# Altium schematic sheet medusa-AI-sensors.SchDoc
size A
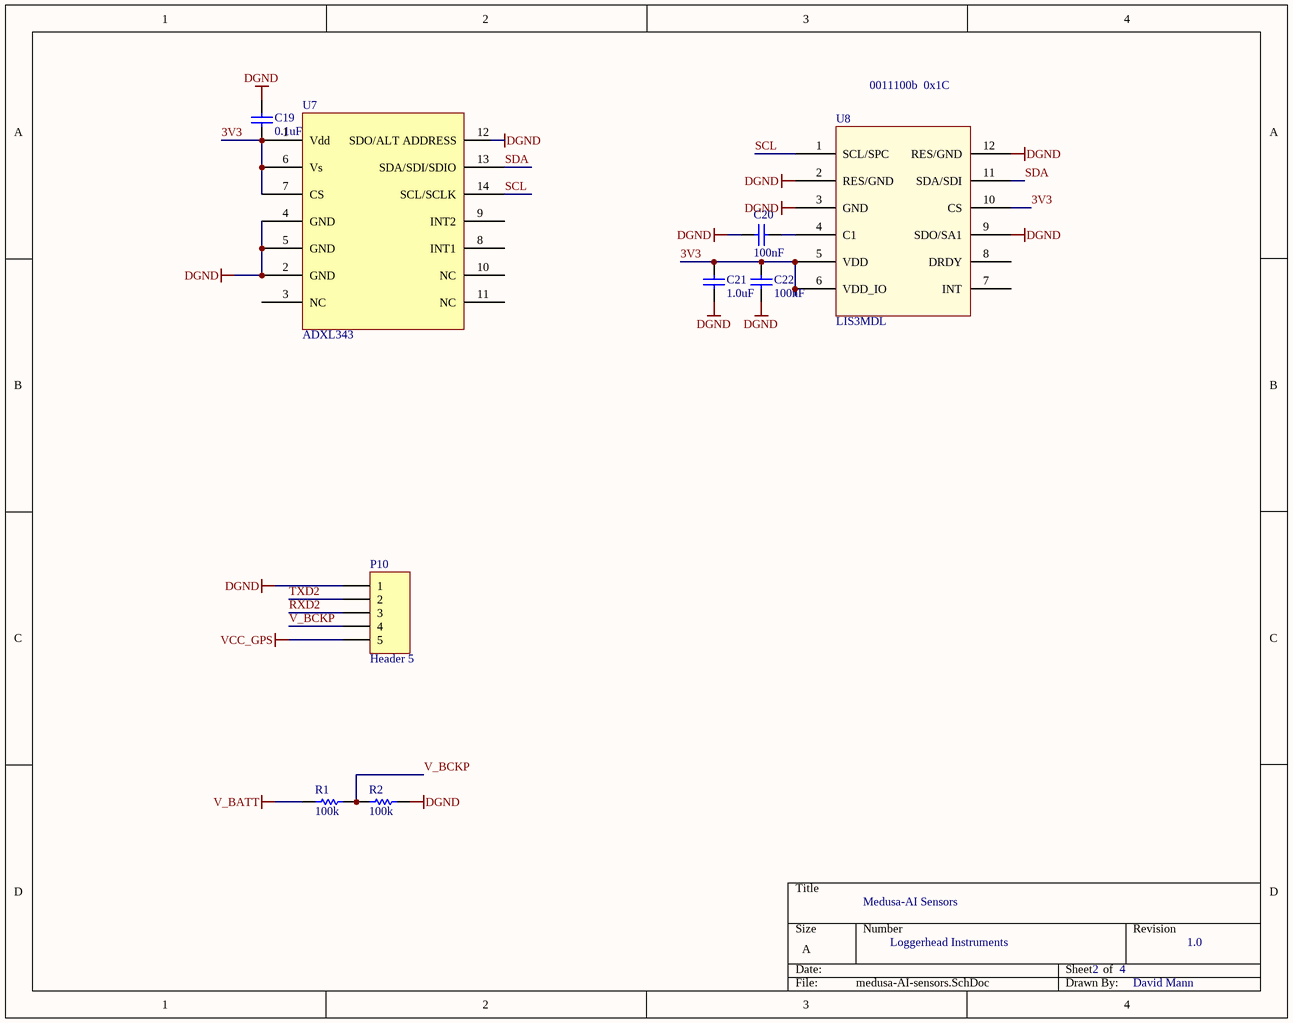
[diagram p0: medusa-AI-sensors.SchDoc]

## Parts
C19  0.1uF  [0402]
C20  100nF  [0402]
C21  1.0uF  [0402]
C22  100nF  [0402]
P10  Header 5  [HDR1X5]
R1  100k  [3-0603]
R2  100k  [3-0603]
U7  ADXL343  [ADXL345]
U8  LIS3MDL  [LGA-12]

## Nets
DGND: C19.2 C20.1 C21.2 C22.2 P10.1 R2.1 U7.2(GND) U7.4(GND) U7.5(GND) U7.12(SDO/ALT_ADDRESS) U8.2(RES/GND) U8.3(GND) U8.9(SDO/SA1) U8.12(RES/GND)
V_BATT: R1.2
VCC_GPS: P10.5
3V3: C19.1 C21.1 C22.1 U7.1(Vdd) U7.6(Vs) U7.7(CS) U8.5(VDD) U8.6(VDD_IO) U8.10(CS)
RXD2: P10.3
SCL: U7.14(SCL/SCLK) U8.1(SCL/SPC)
SDA: U7.13(SDA/SDI/SDIO) U8.11(SDA/SDI)
TXD2: P10.2
V_BCKP: P10.4 R1.1 R2.2
NetC20_2: C20.2 U8.4(C1)

Not connected (* = marked no-connect by the designer): U7 3(NC) 8(INT1) 9(INT2) 10(NC) 11(NC); U8 7(INT) 8(DRDY)

## Notes on the sheet
- 0011100b  0x1C
- Medusa-AI Sensors
- Loggerhead Instruments
- 2
- 4
- 1.0
- David Mann

## Library data of the parts
C19 C21 = C0402: Ceramic Chip Capacitor - Standard; Note: Footprint corresponds to dimensions for bulk cassette packaging. This case size has tightened tolerances.; Published: 17-Jul-2002; LatestRevisionDate: 19-Mar-2004; LatestRevisionNote: Silkscreen size reduced.; DatasheetDocument: Mar-2001; PackageDocument: Mar-2001; PackageReference: 0402; Publisher: Altium Limited; Code_JEITA: 0402; Code_IPC: 1005 [0402]; ComponentLink1Description: Manufacturer Link; ComponentLink1URL: http://www.kemet.com/; ComponentLink2Description: Datasheet; ComponentLink2URL: http://www.kemet.com/kemet/web/homepage/kechome.nsf/vapubfilesname/F3102TA.pdf/$file/F3102TA.pdf
  C19: Value: 0.1uF
  C21: Value: 1.0uF
C20 C22 = C0402: Ceramic Chip Capacitor - Standard; Note: Footprint corresponds to dimensions for bulk cassette packaging. This case size has tightened tolerances.; Value: 1.0uF; Published: 17-Jul-2002; LatestRevisionDate: 19-Mar-2004; LatestRevisionNote: Silkscreen size reduced.; DatasheetDocument: Mar-2001; PackageDocument: Mar-2001; PackageReference: 0402; Publisher: Altium Limited; Code_JEITA: 0402; Code_IPC: 1005 [0402]; ComponentLink1Description: Manufacturer Link; ComponentLink1URL: http://www.kemet.com/; ComponentLink2Description: Datasheet; ComponentLink2URL: http://www.kemet.com/kemet/web/homepage/kechome.nsf/vapubfilesname/F3102TA.pdf/$file/F3102TA.pdf
P10 = Header 5: Header, 5-Pin; LatestRevisionDate: 17-Jul-2002; LatestRevisionNote: Re-released for DXP Platform.; Publisher: Altium Limited
R1 R2 = ERJ3RK: Precision Thick Film Chip Resistor, 10 Ohm to 1M Ohm Range, 1% and 0.5% Tolerance, 0603 Size, 0.063 W; Published: 17-Dec-2003; LatestRevisionDate: 19-Mar-2004; LatestRevisionNote: Silkscreen size reduced.; PackageDocument: Mar-2003; PackageReference: 3-0603; Publisher: Altium Limited; Code_IPC: 1608 [0603]; ComponentLink1Description: Manufacturer Link; ComponentLink1URL: http://www.panasonic.com/industrial/components/resistive_products.htm; ComponentLink2Description: Datasheet; ComponentLink2URL: http://www.panasonic.com/industrial/components/pdf/AOA0000CE2.pdf
U7 = ADXL345
U8 = LIS3MDL: magnetometer